# Altium schematic sheet POWER.SchDoc
size A2; SheetNumber: 2; SheetTotal: 7
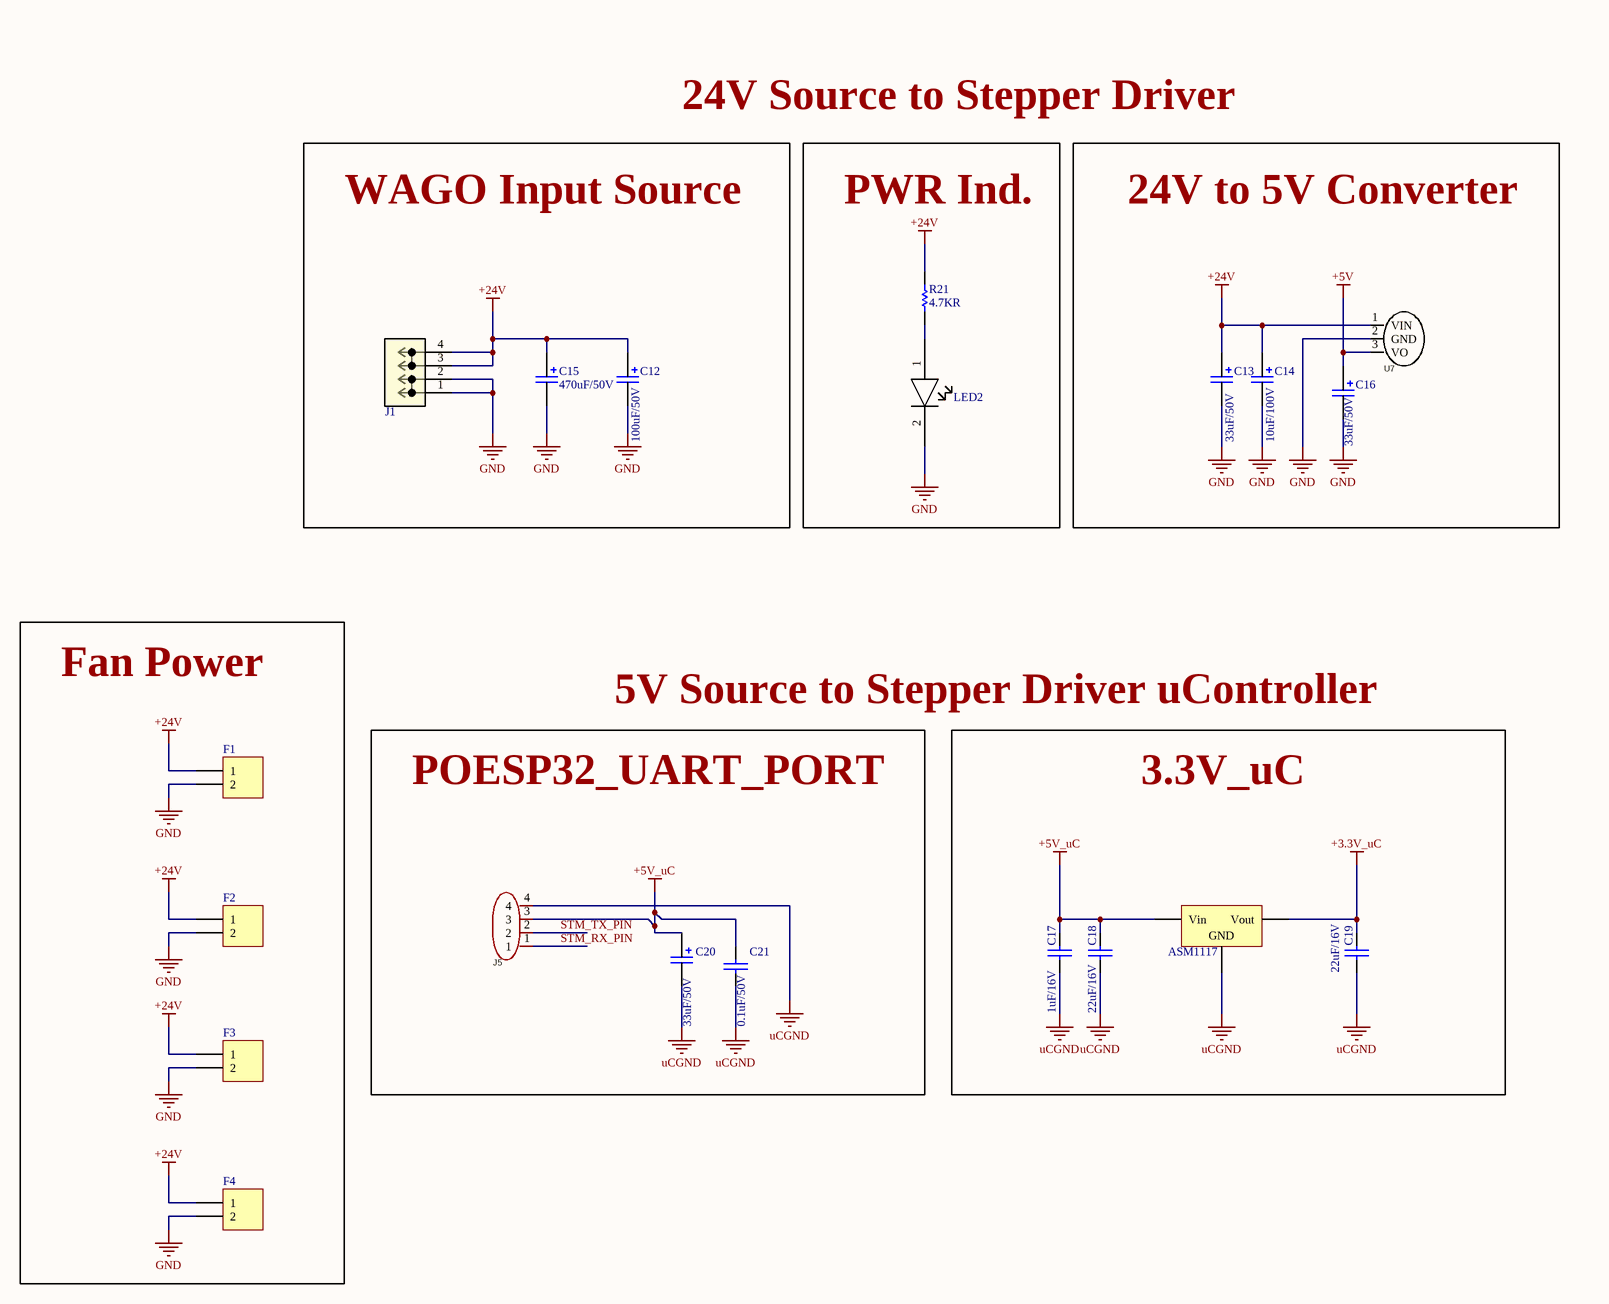
[diagram p0: POWER.SchDoc]

## Parts
ASM1117  AMS1117 - 3.3V Reg  [SOT229P700X180-4N]  (value not drawn)
C12  100uF/50V  [CAPLEAD_D6.3mm]  (no BOM)
C13  33uF/50V  [CAPLEAD_D6.3mm]  (no BOM)
C14  10uF/100V  [CAPLEAD_D6.3mm]  (no BOM)
C15  470uF/50V  [CAPLEAD_D10mm]  (no BOM)
C16  33uF/50V  [CAPLEAD_D6.3mm]  (no BOM)
C17  1uF/16V  [PCBComponent_1]
C18  22uF/16V  [PCBComponent_1]
C19  22uF/16V  [PCBComponent_1]
C20  33uF/50V  [CAPLEAD_D6.3mm]  (no BOM)
C21  0.1uF/50V  [PCBComponent_1]
F1  (no value)  [PinHeader Polar]  (no BOM)
F2  (no value)  [PinHeader Polar]  (no BOM)
F3  (no value)  [PinHeader Polar]  (no BOM)
F4  (no value)  [PinHeader Polar]  (no BOM)
J1  Terminal Block  [CONN2_235-402331-000_WAGO]  (value not drawn)  (no BOM)
J5  Header 4P*2mm  [CONN-TH_4P-P2.00_HX20020-4A_2]  (value not drawn)  (no BOM)
LED2  1206 LED  [1206 LED]  (value not drawn)
R21  4.7KR  [R0402]
U7  C5369649  [SIP-3]  (value not drawn)  (no BOM)

## Blocks framed on the sheet
WAGO Input Source: C12 C15 J1
PWR Ind.: LED2 R21
24V to 5V Converter: C13 C14 C16 U7
Fan Power: F1-F4
POESP32_UART_PORT: C20 C21 J5
3.3V_uC: ASM1117 C17-C19

## Nets
+3.3V_uC: ASM1117.Vout C19.2
+5V: C16.1 U7.3(VO)
+5V_uC: ASM1117.Vin C17.2 C18.2 C20.1 C21.2 J5.3
+24V: C12.1 C13.1 C14.1 C15.1 F1.1 F2.1 F3.1 F4.1 J1.3(2_1) J1.4(2_2) R21.1 U7.1(VIN)
GND: C12.2 C13.2 C14.2 C15.2 C16.2 F1.2 F2.2 F3.2 F4.2 J1.1(1_1) J1.2(1_2) LED2.2 U7.2(GND)
uCGND: ASM1117.GND C17.1 C18.1 C19.1 C20.2 C21.1 J5.4
STM_RX_PIN: J5.1
STM_TX_PIN: J5.2
NetLED2_1: LED2.1 R21.2

## Notes on the sheet
- 24V Source to Stepper Driver
- 5V Source to Stepper Driver uController

## Library data of the parts
ASM1117 = AMS1117 - 3.3V Reg: C347222; Created By: NourAldin
C12 = A759EQ475M2AAAE160: C47891; Manufacturer: KEMET; Supplier 1: Mouser; Manufacturer Part Number: A759EQ475M2AAAE160; RoHS: Yes; Category: Polymer Capacitors; Stock 1: 17219; Pricing 1: 1=0.97, 10=0.73, 50=0.73, 100=0.546, 1000=0.384, 10000=0.326 (USD); ComponentLink1URL: http://www.kemet.com/docfinder?Partnumber=A759EQ475M2AAAE160&src-supplier=Digikey; ComponentLink1Description: http://www.kemet.com/docfinder?Partnumber=A759EQ475M2AAAE160&src-supplier=Digikey; ComponentLink2URL: http://www.farnell.com/datasheets/2095614.pdf?src-supplier=Element14; ComponentLink2Description: http://www.farnell.com/datasheets/2095614.pdf?src-supplier=Element14; Supplier Part Number 1: 80-A759EQ475M2AAE160
C13 C16 C20 = A759EQ475M2AAAE160: C45099; Manufacturer: KEMET; Supplier 1: Mouser; Manufacturer Part Number: A759EQ475M2AAAE160; RoHS: Yes; Category: Polymer Capacitors; Stock 1: 17219; Pricing 1: 1=0.97, 10=0.73, 50=0.73, 100=0.546, 1000=0.384, 10000=0.326 (USD); ComponentLink1URL: http://www.kemet.com/docfinder?Partnumber=A759EQ475M2AAAE160&src-supplier=Digikey; ComponentLink1Description: http://www.kemet.com/docfinder?Partnumber=A759EQ475M2AAAE160&src-supplier=Digikey; ComponentLink2URL: http://www.farnell.com/datasheets/2095614.pdf?src-supplier=Element14; ComponentLink2Description: http://www.farnell.com/datasheets/2095614.pdf?src-supplier=Element14; Supplier Part Number 1: 80-A759EQ475M2AAE160
C14 = A759EQ475M2AAAE160: C2029; Manufacturer: KEMET; Supplier 1: Mouser; Manufacturer Part Number: A759EQ475M2AAAE160; RoHS: Yes; Category: Polymer Capacitors; Stock 1: 17219; Pricing 1: 1=0.97, 10=0.73, 50=0.73, 100=0.546, 1000=0.384, 10000=0.326 (USD); ComponentLink1URL: http://www.kemet.com/docfinder?Partnumber=A759EQ475M2AAAE160&src-supplier=Digikey; ComponentLink1Description: http://www.kemet.com/docfinder?Partnumber=A759EQ475M2AAAE160&src-supplier=Digikey; ComponentLink2URL: http://www.farnell.com/datasheets/2095614.pdf?src-supplier=Element14; ComponentLink2Description: http://www.farnell.com/datasheets/2095614.pdf?src-supplier=Element14; Supplier Part Number 1: 80-A759EQ475M2AAE160
C15 = MAL215058101E3: C2960279; Manufacturer: Vishay BCcomponents; Manufacturer Part Number: MAL215058101E3; RoHS: Yes; Category: Aluminum Electrolytic Capacitors; Stock 1: 1562; Pricing 1: 1=1.45, 10=1.09, 50=1.09, 100=0.799, 1000=0.585, 10000=0.496 (USD); ComponentLink1URL: https://datasheet.ciiva.com/11697/150rmi-11697723.pdf?src-supplier=Avnet; ComponentLink1Description: https://datasheet.ciiva.com/11697/150rmi-11697723.pdf?src-supplier=Avnet; Supplier 1: Mouser; Supplier 2: LCSC; Supplier Part Number 2: C1596751; Supplier Part Number 1: 594-2222-150-58101
C17 = 0603 Capacitor: C1592; Created By: NourAldin; DataSheet Link: https://eu.mouser.com/datasheet/2/400/lcc_automotive_general_en-843974.pdf; Mouser Link: https://eu.mouser.com/ProductDetail/TDK/CGA1A2X7R1H331M030BA?qs=sGAEpiMZZMs0AnBnWHyRQL8L3bkL%252bvtyS9XpSB1mk7rVV5K8%252bbxEeg%3d%3d
C18 C19 = 0603 Capacitor: C2762594; Created By: NourAldin; DataSheet Link: https://eu.mouser.com/datasheet/2/400/lcc_automotive_general_en-843974.pdf; Mouser Link: https://eu.mouser.com/ProductDetail/TDK/CGA1A2X7R1H331M030BA?qs=sGAEpiMZZMs0AnBnWHyRQL8L3bkL%252bvtyS9XpSB1mk7rVV5K8%252bbxEeg%3d%3d
C21 = 0603 Capacitor: C1591; Created By: NourAldin; DataSheet Link: https://eu.mouser.com/datasheet/2/400/lcc_automotive_general_en-843974.pdf; Mouser Link: https://eu.mouser.com/ProductDetail/TDK/CGA1A2X7R1H331M030BA?qs=sGAEpiMZZMs0AnBnWHyRQL8L3bkL%252bvtyS9XpSB1mk7rVV5K8%252bbxEeg%3d%3d
F1-F4 = Header 2 pin: Created By: NourAldin
J1 = 235-402331-000: C7461083; Mfr_Name: Wago; RefDes: RefDes; Type: Type
J5 = ZX-HY2.0-4PZZ: C42372479; Manufacturer: Megastar(兆星); Add into BOM: yes; Pins Structure: 1x4P; Pitch: 2mm; Reference Series: HY; Number of PINs Per Row: 4; Current Rating (Max): 2A; Rated Voltage (Max): 250V; Flame Retardant Rating: UL94V-0; Z-Height of the Board: 8mm; X-Length of Bottom Edge on Board (Spacing Line): 10mm; Y-Width of Bottom Edge on Board: 5.1mm; Symbol: ZX-HY2.0-4PZZ; Device: ZX-HY2.0-4PZZ; LCSC Part Name: 1x4P 间距:2mm 直插 系列:HY 配套胶壳型号：ZX-HY2.0-4PJK 配套端子型号：ZX-HY2.0-DZ 配套杜邦线型号：ZX-HY2.0-4PBXC; Supplier Part: C7429580; Manufacturer Part: ZX-HY2.0-4PZZ; Supplier Footprint: 插件,P=2mm; JLCPCB Part Class: Extended Part; Datasheet: https://atta.szlcsc.com/upload/public/pdf/source/20241025/5A7CD93910E89EF197073334521200FC.pdf; Supplier: LCSC; Convert to PCB: yes; Mounting Style: Direct Insert; Number of Pins: 4P; Number of Rows: 1; Row Spacing: -; Contact Material: Brass; Contact Plating: Tin; Operating Temperature Range: -25℃~+85℃; Plastic Material: -; Supplementary Features: -; Colour: White
LED2 = 1206 LED: C434442; Created By: NourAldin
R21 = 0402 Resistor: C105871
U7 = K7805M-1000R3_C5369649: Manufacturer: YLPTEC(易川); Add into BOM: yes; Conversion Type: DC-DC; Function: Boost type; Input Voltage(DC): 7V~36V; Output Voltage: 5V; Output Power: 5W; Output Current (Max): 1000mA; Output Channel: 1; Conversion Efficiency: 94%; Maximum Capacitive Load: 2200uF; Symbol: K7805M-1000R3_C5369649; Device: K7805M-1000R3_C5369649; LCSC Part Name: K7805M-1000R3; Supplier Part: C5369649; Manufacturer Part: K7805M-1000R3; Supplier Footprint: SIP-3; JLCPCB Part Class: Extended Part; Datasheet: https://atta.szlcsc.com/upload/public/pdf/source/20230612/70568B8922D00E56BE7D7C892197C716.pdf; Supplier: LCSC; Convert to PCB: yes; Feature: Short-Circuit  Protection；Low-Power Consumption